# Altium project Dashcam_V2.0B.PrjPcb (part 6 of 9)

## Sheet TYPEC_DATA.SchDoc
size A2; DrawnBy: UKAYACIK; Engineer: UKAYACIK; DocumentNumber: 16; Revision: B; SheetNumber: 16; SheetTotal: 21
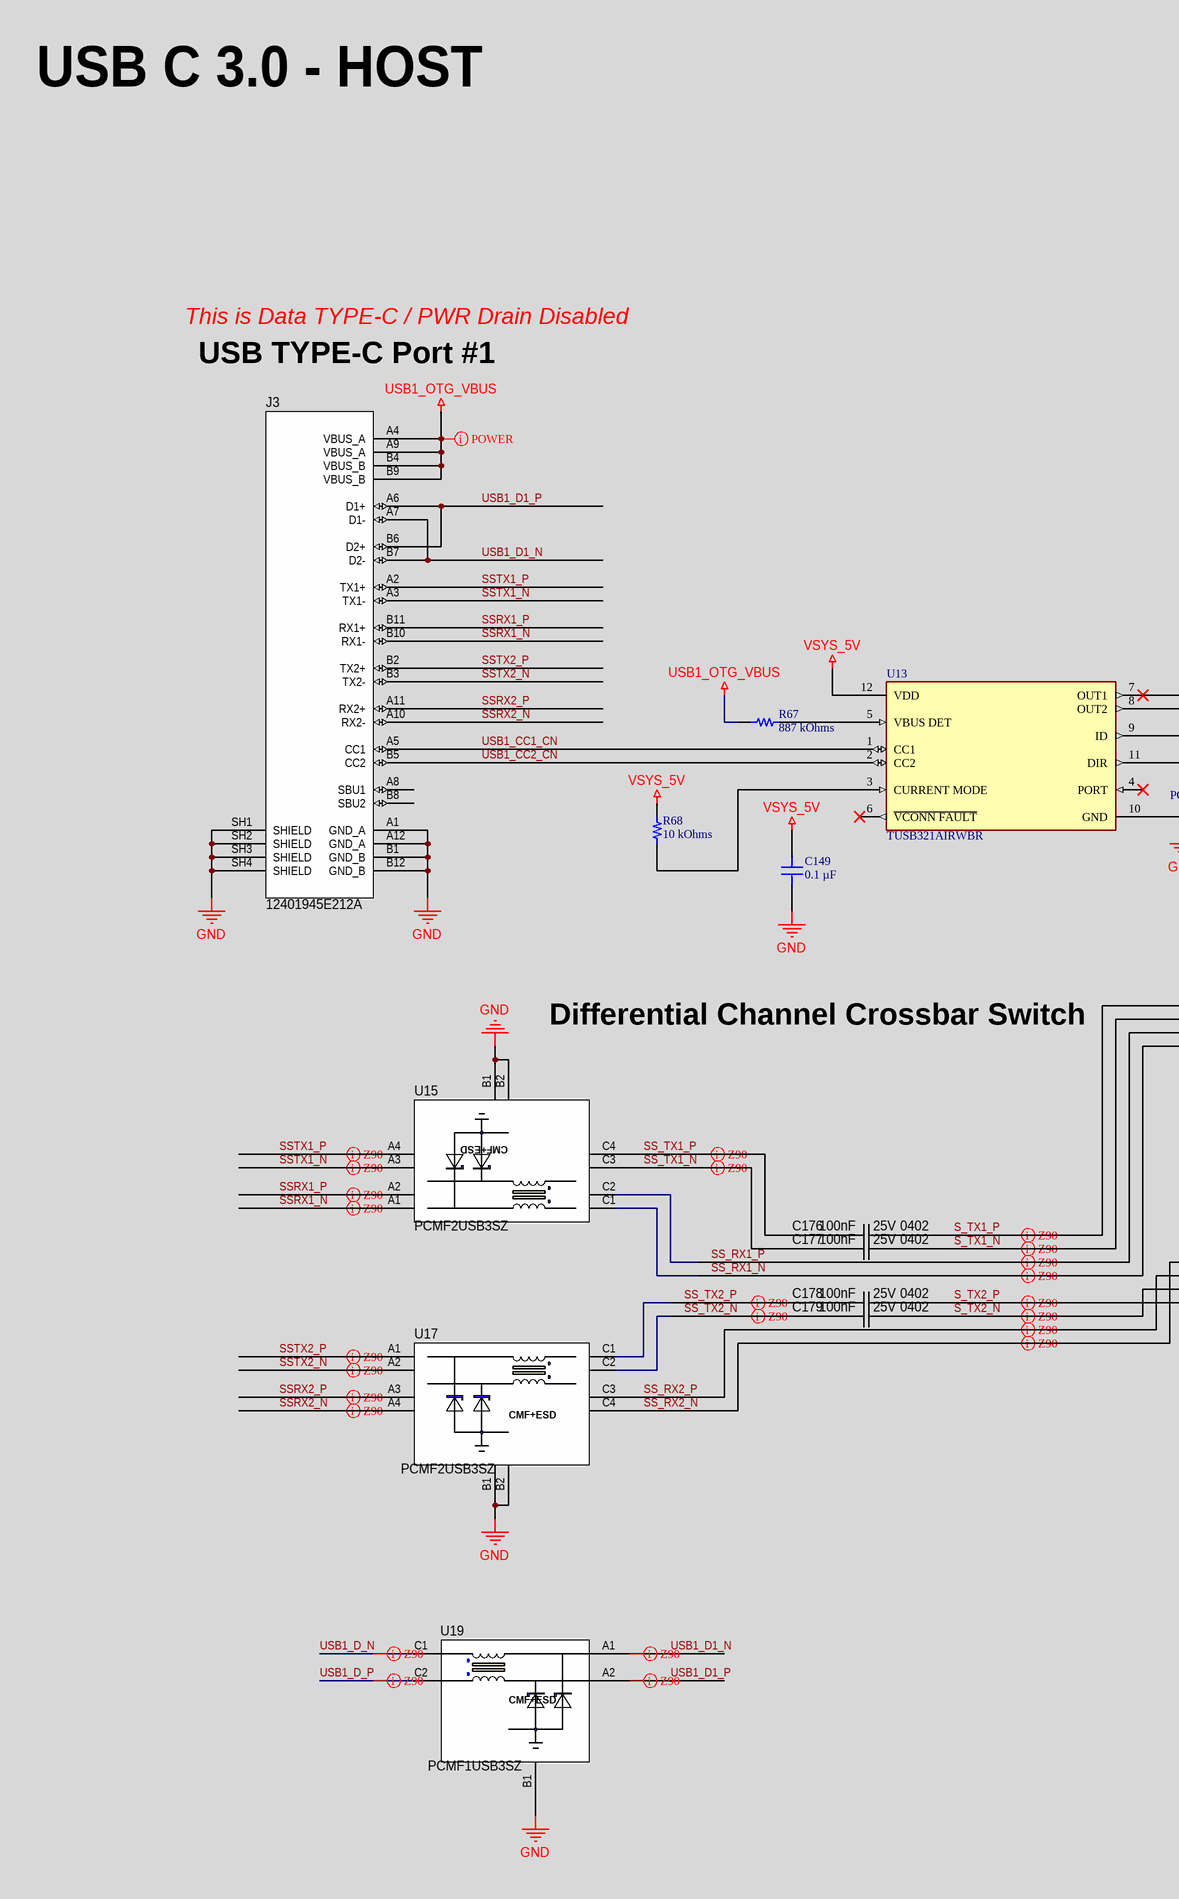
[diagram p18: TYPEC_DATA.SchDoc, left]
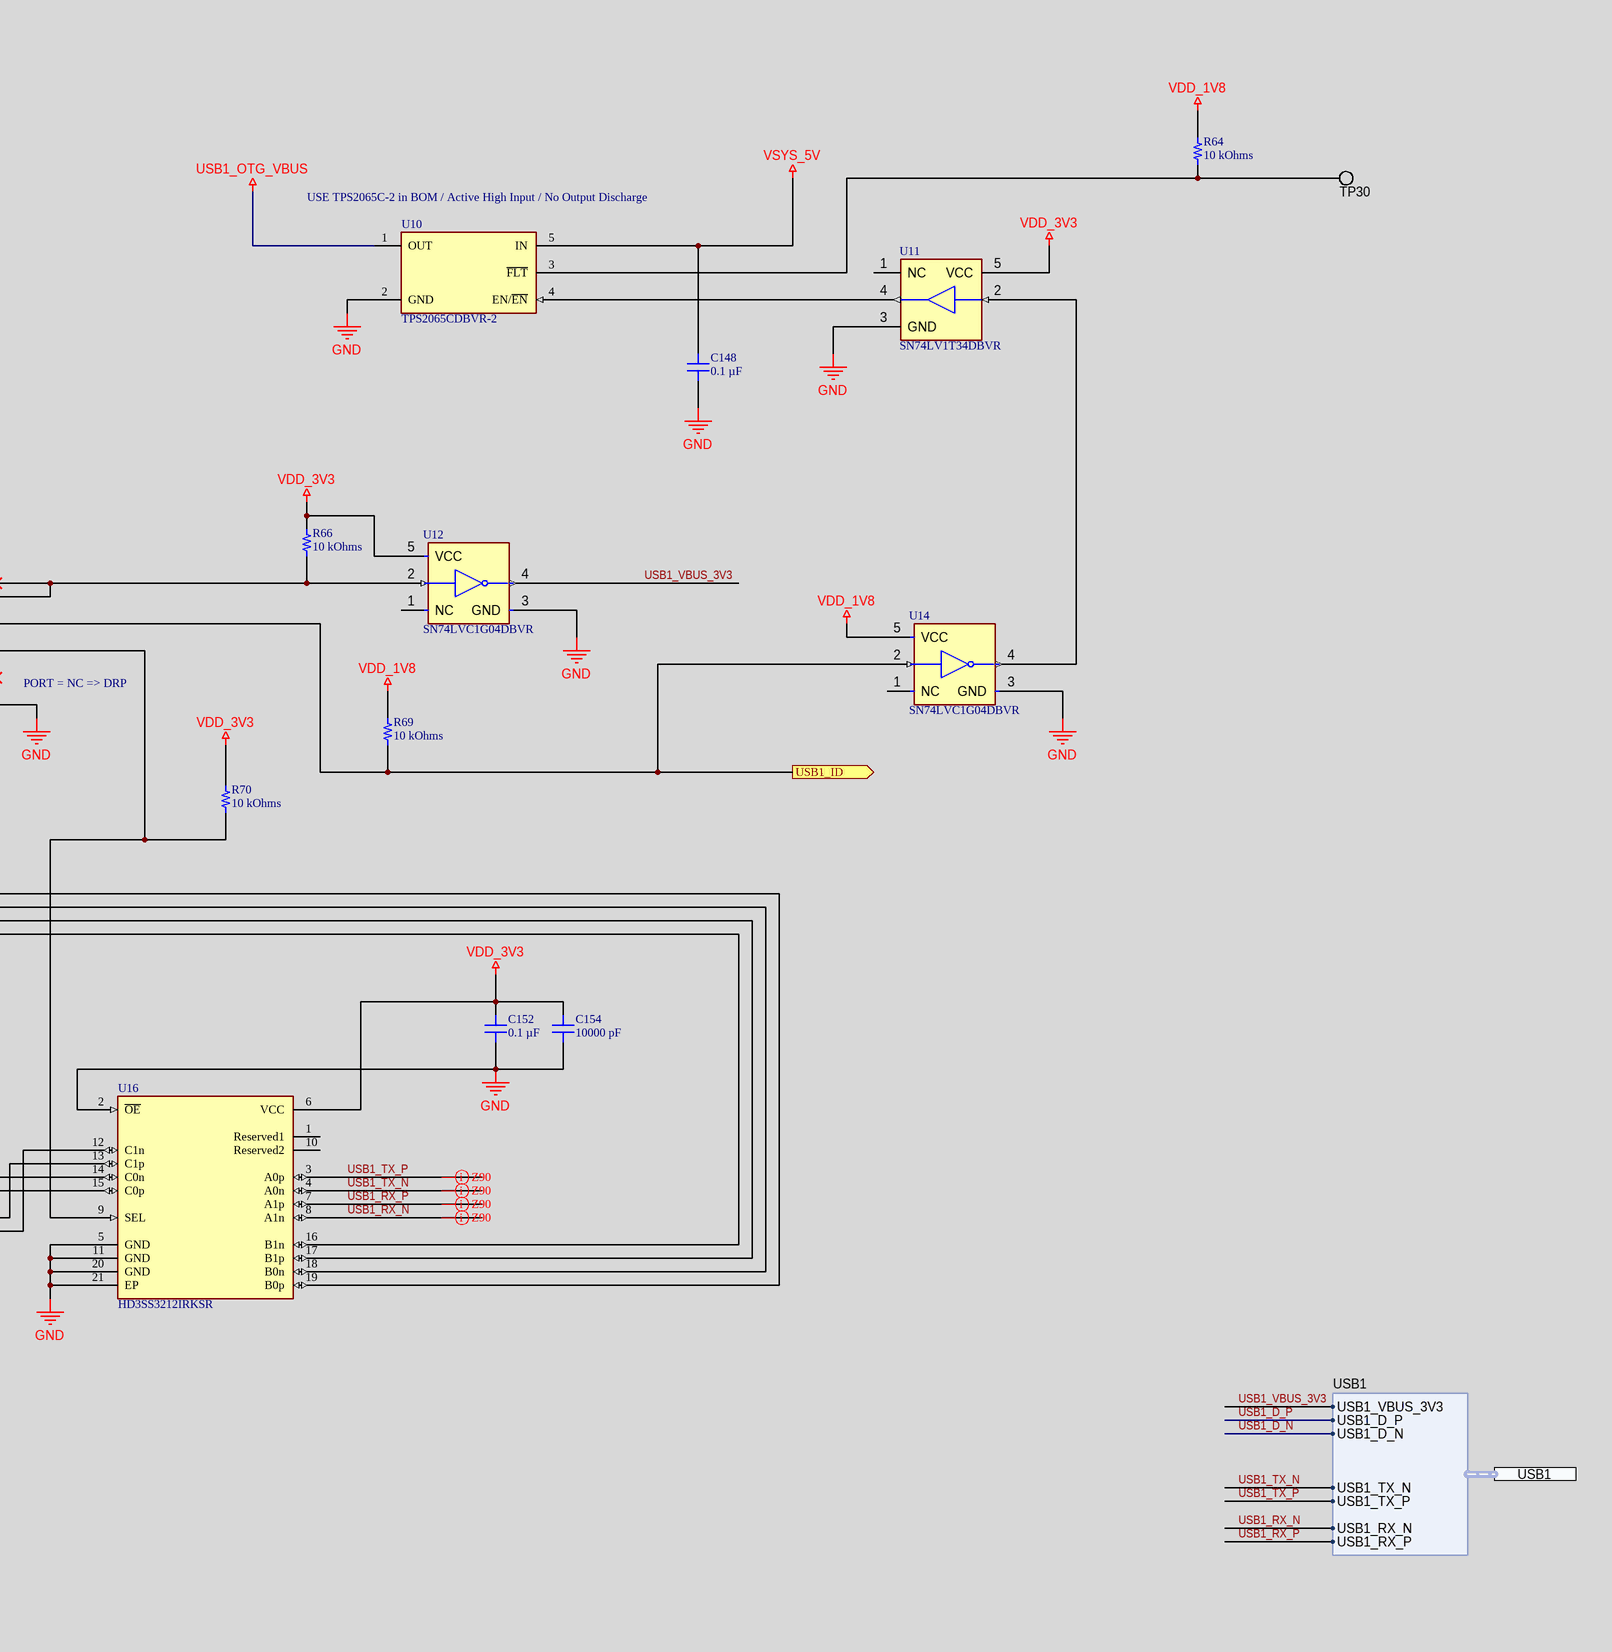
[diagram p19: TYPEC_DATA.SchDoc, right]

### Parts
C148  0.1 µF  [MURATA GCM155 0402_1005]
C149  0.1 µF  [MURATA GCM155 0402_1005]
C152  0.1 µF  [MURATA GCM155 0402_1005]
C154  10000 pF  [CAP 0402_1005]
C176  Capacitance: 100nF  Voltage Rating: 25V  Case/Package: 0402  [CAP_0402_CAPC1005X05N]  (hidden comment: CC0402KRX5R8BB104)
C177  Capacitance: 100nF  Voltage Rating: 25V  Case/Package: 0402  [CAP_0402_CAPC1005X05N]  (hidden comment: CC0402KRX5R8BB104)
C178  Capacitance: 100nF  Voltage Rating: 25V  Case/Package: 0402  [CAP_0402_CAPC1005X05N]  (hidden comment: CC0402KRX5R8BB104)
C179  Capacitance: 100nF  Voltage Rating: 25V  Case/Package: 0402  [CAP_0402_CAPC1005X05N]  (hidden comment: CC0402KRX5R8BB104)
J3  12401945E212A  [CONN_USBC_AMPHENOL_12401945E212A]
R64  10 kOhms  [RES 0402_1005]
R66  10 kOhms  [RES 0402_1005]
R67  887 kOhms  [RES 0805_2012]
R68  10 kOhms  [RES 0402_1005]
R69  10 kOhms  [RES 0402_1005]
R70  10 kOhms  [RES 0402_1005]
TP30  NO COMPONENT  [TP_PAD_0.5MM_SMD_ROUND]  (value not drawn)  (no BOM)
U10  TPS2065CDBVR-2  [FP-DBV0005A-IPC_A]
U11  SN74LV1T34DBVR  [FP-DBV0005A-IPC_B]
U12  SN74LVC1G04DBVR  [FP-DBV0005A-MFG]
U13  TUSB321AIRWBR  [FP-RWB0012A-MFG]
U14  SN74LVC1G04DBVR  [FP-DBV0005A-MFG]
U15  PCMF2USB3SZ  [ESD_PCMF2USB3SZ]
U16  HD3SS3212IRKSR  [FP-RKS0020A-MFG]
U17  PCMF2USB3SZ  [ESD_PCMF2USB3SZ]
U19  PCMF1USB3SZ  [ESD_PESD1USB3BCX]

### Ports
USB1 (harness USB1), USB1_ID (out)

### Harnesses
USB1: USB1_VBUS_3V3, USB1_D_N, USB1_D_P, USB1_TX_N, USB1_TX_P, USB1_RX_N, USB1_RX_P

### Nets
GND: C148.1 C149.1 C152.1 C154.1 J3.A1(GND_A) J3.A12(GND_A) J3.B1(GND_B) J3.B12(GND_B) J3.SH1(SHIELD) J3.SH2(SHIELD) J3.SH3(SHIELD) J3.SH4(SHIELD) U10.2(GND) U11.3(GND) U12.3(GND) U13.10(GND) U14.3(GND) U15.B1(GND_CH1) U15.B2(GND_CH2) U16.2(~{OE}) U16.5(GND) U16.11(GND) U16.20(GND) U16.21(EP) U17.B1(GND_CH1) U17.B2(GND_CH2) U19.B1(ground_channel_1)
USB1_OTG_VBUS: J3.A4(VBUS_A) J3.A9(VBUS_A) J3.B4(VBUS_B) J3.B9(VBUS_B) R67.1 U10.1(OUT)
VDD_1V8: R64.2 R69.2 U14.5(VCC)
VDD_3V3: C152.2 C154.2 R66.2 R70.2 U11.5(VCC) U12.5(VCC) U16.6(VCC)
VSYS_5V: C148.2 C149.2 R68.2 U10.5(IN) U13.12(VDD)
GPIO1_IO15: R69.1 U13.9(ID) U14.2(A) ; port USB1_ID
S_TX1_N: C177.2 U16.18(B0n)
S_TX1_P: C176.2 U16.19(B0p)
S_TX2_N: C179.2 U16.14(C0n)
S_TX2_P: C178.2 U16.15(C0p)
SS_RX1_N: U15.C1(CH1_OUT+) U16.16(B1n)
SS_RX1_P: U15.C2(CH1_OUT-) U16.17(B1p)
SS_RX2_N: U16.12(C1n) U17.C4(CH2_OUT-)
SS_RX2_P: U16.13(C1p) U17.C3(CH2_OUT+)
SS_TX1_N: C177.1 U15.C3(CH2_OUT+)
SS_TX1_P: C176.1 U15.C4(CH2_OUT-)
SS_TX2_N: C179.1 U17.C2(CH1_OUT-)
SS_TX2_P: C178.1 U17.C1(CH1_OUT+)
SSRX1_N: J3.B10(RX1-) U15.A1(CH1_IN+)
SSRX1_P: J3.B11(RX1+) U15.A2(CH1_IN-)
SSRX2_N: J3.A10(RX2-) U17.A4(CH2_IN-)
SSRX2_P: J3.A11(RX2+) U17.A3(CH2_IN+)
SSTX1_N: J3.A3(TX1-) U15.A3(CH2_IN+)
SSTX1_P: J3.A2(TX1+) U15.A4(CH2_IN-)
SSTX2_N: J3.B3(TX2-) U17.A2(CH1_IN-)
SSTX2_P: J3.B2(TX2+) U17.A1(CH1_IN+)
USB1_CC1_CN: J3.A5(CC1) U13.1(CC1)
USB1_CC2_CN: J3.B5(CC2) U13.2(CC2)
USB1_D1_N: J3.A7(D1-) J3.B7(D2-) U19.A1(channel_1+_external)
USB1_D1_P: J3.A6(D1+) J3.B6(D2+) U19.A2(channel_1-_external)
USB1_D_N: U19.C1(channel_1+_internal) ; port USB1.USB1_D_N
USB1_D_P: U19.C2(channel_1-_internal) ; port USB1.USB1_D_P
USB1_RX_N: U16.8(A1n) ; port USB1.USB1_RX_N
USB1_RX_P: U16.7(A1p) ; port USB1.USB1_RX_P
USB1_TX_N: U16.4(A0n) ; port USB1.USB1_TX_N
USB1_TX_P: U16.3(A0p) ; port USB1.USB1_TX_P
USB1_VBUS_3V3: U12.4(Y) ; port USB1.USB1_VBUS_3V3
NetR64_1: R64.1 TP30.1 U10.3(~{FLT})
NetR66_1: R66.1 U12.2(A) U13.7(OUT1) U13.8(OUT2)
NetR67_2: R67.2 U13.5(VBUS_DET)
NetR68_1: R68.1 U13.3(CURRENT_MODE)
NetR70_1: R70.1 U13.11(DIR) U16.9(SEL)
NetU10_4: U10.4(EN/~{EN}) U11.4(Y)
NetU11_2: U11.2(A) U14.4(Y)

Not connected (* = marked no-connect by the designer): J3 A8(SBU1) B8(SBU2); U11 1(NC); U12 1(NC); U13 4(PORT)* 6(~{VCONN_FAULT})*; U14 1(NC); U16 1(Reserved1) 10(Reserved2)

### Layout directives
differential pair; differential pair class Z90: S_TX1_N, S_TX1_P, S_TX2_N, S_TX2_P, SS_RX1_N, SS_RX1_P, SS_RX2_N, SS_RX2_P, SS_TX1_N, SS_TX1_P, SS_TX2_N, SS_TX2_P, SSRX1_N, SSRX1_P, SSRX2_N, SSRX2_P, SSTX1_N, SSTX1_P, SSTX2_N, SSTX2_P, USB1_D1_N, USB1_D1_P, USB1_D_N, USB1_D_P, USB1_RX_N, USB1_RX_P, USB1_TX_N, USB1_TX_P
net class POWER: USB1_OTG_VBUS

### Notes on the sheet
- USB C 3.0 - HOST
- (near U10) USE TPS2065C-2 in BOM / Active High Input / No Output Discharge
- This is Data TYPE-C / PWR Drain Disabled
- USB TYPE-C Port #1
- PORT = NC => DRP
- Differential Channel Crossbar Switch
- PCB Des :
- Approv By :
- Project Title :
- Sheet Title :
- Date :
- Page :
- PCB Version :
- PCB Revision :
- Size :
- A2
- (in symbol ESD_EMI_PCMF1USB3SZ) CMF+ESD
- (in symbol ESD_EMI_PCMF2USB3SZ) CMF+ESD

### Library data of the parts
C148 C149 C152 = GCM155R71E104KE02D: CAP CER 0.1UF 25V X7R 0402; manufacturer: Murata Electronics; Tolerance: ±10%; Part Number: GCM155R71E104KE02D; Capacitance: 0.1 µF; Applications: Automotive; componentlink1description: Datasheet; componentlink1url: https://search.murata.co.jp/Ceramy/image/img/A01X/G101/ENG/GCM155R71E104KE02-01.pdf; componentlink2description: DigiKey Link; componentlink2url: https://www.digikey.com/en/products/detail/murata-electronics/GCM155R71E104KE02D/7363175; Device Package: 0402 (1005 Metric); lastupdated: 7/20/2024 2:04:19 AM; Lifecycle Status: Active; Minimum Order: 1; Mounting Type: Surface Mount, MLCC; Operating Temperature: -55°C ~ 125°C; Package / Case: 0402 (1005 Metric); packaging: TapeAndReel; partid: 2051; Part Status: Active; price: 0.01; Ratings: AEC-Q200; series: GCM; Size / Dimension: 0.039" L x 0.020" W (1.00mm x 0.50mm); Supplier 1: DigiKey; Supplier Part Number 1: 490-16431-1-ND; Temperature Coefficient: X7R; Thickness (Max): 0.022" (0.55mm); value: 0.1 µF; Voltage - Rated: 25V
C154 = C0402C103M5RECAUTO: CAP CER 0402 10NF 50V X7R 20%; manufacturer: KEMET; Part Number: C0402C103M5RECAUTO; Capacitance: 10000 pF; Applications: Automotive, ESD Protection; componentlink1description: Datasheet; componentlink1url: https://api.kemet.com/component-edge/download/datasheet/C0402C103M5RECAUTO.pdf; componentlink2description: DigiKey Link; componentlink2url: https://www.digikey.com/en/products/detail/kemet/C0402C103M5RECAUTO/8646509; Device Package: 0402 (1005 Metric); lastupdated: 2/9/2024 8:04:13 PM; Lifecycle Status: Active; Minimum Order: 1; Mounting Type: Surface Mount, MLCC; Operating Temperature: -55°C ~ 125°C; Package / Case: 0402 (1005 Metric); packaging: TapeAndReel; partid: 33125; Part Status: Active; price: 0.01; Ratings: AEC-Q200; series: ESD SMD Auto X7R; Size / Dimension: 0.039" L x 0.020" W (1.00mm x 0.50mm); Supplier 1: DigiKey; Supplier Part Number 1: 399-C0402C103M5RECAUTOCT-ND; Temperature Coefficient: X7R; Thickness (Max): 0.022" (0.55mm); Tolerance: ±20%; value: 10000 pF; Voltage - Rated: 50V
C176-C179 = CAP_100NF_25V_X7R_0402: Multilayer Ceramic Capacitor, 0.1 uF, 25 V, ± 10%, X7R, 0402 [1005 Metric]; Manufacturer: Yageo; Material: 4241ConductorMaterial; Dielectric: X5R; Temperature Coefficient: 30ppm/°C; Supplier 1: Digikey; Manufacturer Part Number: CC0402KRX5R8BB104; RoHS: Yes; Category: Ceramic Capacitors; Stock 1: 3706055; Pricing 1: 1=0.1, 10=0.037, 50=0.021, 100=0.0162, 500=0.01224, 1000=0.00961, 2500=0.00874, 5000=0.00804 (USD); Mount: Surface Mount; Case Code (Metric): 1005; Case Code (Imperial): 0402; Min Operating Temperature: -55°C; Max Operating Temperature: 85°C; Tolerance: 10%; Packaging: Tape and Reel; Voltage Rating (DC): 25V; Series: CC; RoHS Compliant: Yes; Lead Free: 5697LeadFree; Halogen Free: 5694HalogenFree; ComponentLink1URL: http://www.mouser.com/ds/2/447/UPY-GPHC_X5R_4V-to-50V_25-1131599.pdf?src-supplier=Mouser; ComponentLink1Description: http://www.mouser.com/ds/2/447/UPY-GPHC_X5R_4V-to-50V_25-1131599.pdf?src-supplier=Mouser; ComponentLink2URL: https://datasheet.octopart.com/CC0402KRX5R8BB104-Yageo-datasheet-137700082.pdf?src-supplier=Future+Electronics; ComponentLink2Description: https://datasheet.octopart.com/CC0402KRX5R8BB104-Yageo-datasheet-137700082.pdf?src-supplier=Future+Electronics; ComponentLink3URL: http://www.yageo.com/documents/recent/UPY-GPHC_X5R_4V-to-50V_25.pdf?src-supplier=Digikey; ComponentLink3Description: http://www.yageo.com/documents/recent/UPY-GPHC_X5R_4V-to-50V_25.pdf?src-supplier=Digikey; ComponentLink4URL: https://datasheet.octopart.com/CC0402KRX5R8BB104-Yageo-datasheet-140260304.pdf?src-supplier=Newark; ComponentLink4Description: https://datasheet.octopart.com/CC0402KRX5R8BB104-Yageo-datasheet-140260304.pdf?src-supplier=Newark; ComponentLink5URL: https://datasheet.octopart.com/CC0402KRX5R8BB104-Yageo-datasheet-170350636.pdf?src-supplier=Future+Electronics; ComponentLink5Description: https://datasheet.octopart.com/CC0402KRX5R8BB104-Yageo-datasheet-170350636.pdf?src-supplier=Future+Electronics; ComponentLink6URL: http://www.yageo.com/documents/recent/UPY-GPHC_X5R_4V-to-50V-16.pdf?src-supplier=Future+Electronics; ComponentLink6Description: http://www.yageo.com/documents/recent/UPY-GPHC_X5R_4V-to-50V-16.pdf?src-supplier=Future+Electronics; Supplier Part Number 1: 311-1697-6-ND
J3 = CONN_USB_TYPEC_3.2_12401945E212A: USB3.2 GEN1, Type C, Top mount, CH 1.53mm, Dual Row SMT / Tap/Rl; Manufacturer: Amphenol ICC / FCI; Supplier 1: Digikey; Manufacturer Part Number: 12401945E212A; RoHS: No; Category: Connectors; Stock 1: 12310; Pricing 1: 1=1.63, 10=1.415, 25=1.3544, 50=1.3242, 100=1.2641, 250=1.14372, 500=1.05342 (USD); Supplier Part Number 1: 664-12401945E212ACT-ND
R64 R66 R68-R70 = MCS0402MC1002FE000: RES SMD 10K OHM 1% 1/10W 0402; Manufacturer: Vishay Beyschlag; Power (Watts): 0.1W, 1/10W; Temperature Coefficient: ±50ppm/°C; Part Number: MCS0402MC1002FE000; Value: 10 kOhms; ComponentLink1Description: Datasheet; ComponentLink1URL: http://www.vishay.com/docs/28760/mcat_pro.pdf; ComponentLink2Description: DigiKey Link; ComponentLink2URL: http://digikey.com/product-detail/en/vishay-beyschlag/MCS0402MC1002FE000/MCS0402-10.0K-MFCT-ND/3883092; Composition: Thin Film; Device Package: 0402 (1005 Metric); Features: Anti-Sulfur, Automotive AEC-Q200; Height - Seated (Max): 0.015" (0.37mm); LastUpdated: 2/9/2024 8:30:21 PM; Lifecycle Status: Active; Minimum Order: 1; Number of Terminations: 2; Operating Temperature: -55°C ~ 175°C; Package / Case: 0402 (1005 Metric); Packaging: TapeAndReel; PartId: 3152; Part Status: Active; Price: 0.03; Ratings: AEC-Q200; Resistance: 10 kOhms; Series: MCS AT - Professional; Size / Dimension: 0.039" L x 0.020" W (1.00mm x 0.50mm); Supplier 1: DigiKey; Supplier Part Number 1: MCS0402-10.0K-MFCT-ND; Supplier Device Package: 0402; Tolerance: ±1%
R67 = CRCW0805887KFKEA: RES SMD 887K OHM 1% 1/8W 0805; Manufacturer: Vishay Dale; Power (Watts): 0.125W, 1/8W; Temperature Coefficient: ±100ppm/°C; Part Number: CRCW0805887KFKEA; Value: 887 kOhms; ComponentLink1Description: Datasheet; ComponentLink1URL: http://www.vishay.com/docs/20035/dcrcwe3.pdf; ComponentLink2Description: DigiKey Link; ComponentLink2URL: https://www.digikey.com/en/products/detail/vishay-dale/CRCW0805887KFKEA/1176010; Composition: Thick Film; Device Package: 0805 (2012 Metric); Features: Automotive AEC-Q200; Height - Seated (Max): 0.020" (0.50mm); LastUpdated: 2/8/2024 9:02:16 PM; Lifecycle Status: Active; Minimum Order: 1; Number of Terminations: 2; Operating Temperature: -55°C ~ 155°C; Package / Case: 0805 (2012 Metric); Packaging: TapeAndReel; PartId: 32881; Part Status: Active; Price: 0.01; Ratings: AEC-Q200; Resistance: 887 kOhms; Series: CRCW; Size / Dimension: 0.079" L x 0.049" W (2.00mm x 1.25mm); Supplier 1: DigiKey; Supplier Part Number 1: 541-887KCCT-ND; Supplier Device Package: 0805; Tolerance: ±1%
TP30 = TP_PAD_SMD_SMALL: as TP24-TP28 on sheet eMMC FLASH
U10 = CMP-04913-000050-1: IC PWR SWITCH N-CHAN 1:1 SOT23-5; Max Input Voltage: 5.5V; Turn-On Delay Time: 2.4ms; Min Input Voltage: 4.5V; Output Current: 1A; Number of Outputs: 1; Max Supply Current: 75uA; On-State Resistance: 86mR; Turn-Off Delay Time: 3.25ms; Packaging: Tape and Reel; Case/Package: SOT-23-5; Series: TPS2065C-2; RoHS Compliant: Yes; Mount: Surface Mount; Operating Supply Voltage: 5.5V; Number of Switches: 1; Min Operating Temperature: -40°C; Max Operating Temperature: 85°C; Package Quantity: 3000; Number of Pins: 5; Lead Free: Lead Free
U11 = CMP-0859-00123-4: IC BUF NON-INVERT 5.5V SOT23-5; Low Level Output Current: 8mA; Polarity: Non-Inverting; Number of Channels: 1; Propagation Delay: 15.5ns; High Level Output Current: -8mA; Quiescent Current: 1uA; Logic Function: Buffer; Min Supply Voltage: 1.6V; Min Operating Temperature: -40°C; Package Quantity: 3000; Max Operating Temperature: 125°C; Operating Supply Current: 8mA; Radiation Hardening: No; REACH SVHC: No SVHC; Number of Bits per Element: 1; Mount: Surface Mount; Number of Outputs: 1; Lead Free: Lead Free; Number of Pins: 5; Weight: 0.000353oz; Number of Output Lines: 1; Number of Elements: 1; Number of Input Lines: 1; Number of Bits: 1; Case/Package: SOT-23-5; Packaging: Tape and Reel; Max Supply Voltage: 5.5V; Number of Inputs: 1
U12 U14 = CMP-0859-00134-4: IC INVERTER 1CH 1-INP SOT23-5; Number of Elements: 1; Turn-On Delay Time: 7.5ns; Propagation Delay: 3.7ns; Max Supply Voltage: 5.5V; Max Output Current: 32mA; Quiescent Current: 10uA; High Level Output Current: -32mA; Schmitt Trigger Input: No; Min Supply Voltage: 1.65V; Number of Circuits: 1; Lead Free: Lead Free; Number of Inputs: 1; Mount: Surface Mount; Length: 3.05mm; Width: 1.75mm; Number of Pins: 5; Case/Package: SOT-23; REACH SVHC: No SVHC; Low Level Output Current: 32mA; Package Quantity: 1; Height: 1.3mm; Radiation Hardening: No; Packaging: Tape and Reel; Output Current: 32mA; Max Operating Temperature: 125°C; Termination: SMD/SMT; Min Operating Temperature: -40°C; Number of Gates: 1; Weight: 0.000557oz; Logic Function: Inverter; Number of Bits: 1; Contact Plating: Tin
U13 = CMP-04877-000015-1: IC INTERFACE SPECIALIZED 12X2QFN; Min Supply Voltage: 4.5V; USB Standard: USB 1.0; Number of Ports: 1; Max Supply Voltage: 5.5V; Packaging: Cut Tape; REACH SVHC: No SVHC; Number of Pins: 12; RoHS Compliant: Yes; Min Operating Temperature: -40°C; Mount: Surface Mount; Lead Free: Lead Free; Max Operating Temperature: 85°C
U15 U17 = ESD_EMI_PCMF2USB3SZ: PCMFxUSB3S - Common-mode EMI filter for differential channels with integrated ESD protection; Manufacturer: Nexperia; Supplier 1: Digikey; Manufacturer Part Number: PCMF2USB3SZ; RoHS: Yes; Category: Common Mode Chokes; Stock 1: 45981; Pricing 1: 1=0.72, 10=0.62, 100=0.4295, 500=0.35888, 1000=0.30542, 2000=0.27202 (USD); RoHS Compliant: Yes; ComponentLink1URL: http://www.farnell.com/datasheets/2043701.pdf?src-supplier=Farnell; ComponentLink1Description: http://www.farnell.com/datasheets/2043701.pdf?src-supplier=Farnell; ComponentLink2URL: http://datasheet.octopart.com/PCMF2USB3SZ-Nexperia-datasheet-97399282.pdf?src-supplier=Rs; ComponentLink2Description: http://datasheet.octopart.com/PCMF2USB3SZ-Nexperia-datasheet-97399282.pdf?src-supplier=Rs; ComponentLink3URL: http://datasheet.octopart.com/PCMF2USB3SZ-Nexperia-datasheet-97399282.pdf?src-supplier=Mouser; ComponentLink3Description: http://datasheet.octopart.com/PCMF2USB3SZ-Nexperia-datasheet-97399282.pdf?src-supplier=Mouser; ComponentLink4URL: http://datasheet.octopart.com/PCMF2USB3SZ-Nexperia-datasheet-97399282.pdf?src-supplier=Avnet; ComponentLink4Description: http://datasheet.octopart.com/PCMF2USB3SZ-Nexperia-datasheet-97399282.pdf?src-supplier=Avnet; ComponentLink5URL: https://datasheet.octopart.com/PCMF2USB3SZ-Nexperia-datasheet-62320956.pdf?src-supplier=Newark; ComponentLink5Description: https://datasheet.octopart.com/PCMF2USB3SZ-Nexperia-datasheet-62320956.pdf?src-supplier=Newark; ComponentLink6URL: https://assets.nexperia.com/documents/data-sheet/PCMFXUSB3S_SER.pdf?src-supplier=Digikey; ComponentLink6Description: https://assets.nexperia.com/documents/data-sheet/PCMFXUSB3S_SER.pdf?src-supplier=Digikey; ComponentLink7URL: http://datasheet.octopart.com/PCMF2USB3SZ-Nexperia-datasheet-97399282.pdf?src-supplier=Digikey; ComponentLink7Description: http://datasheet.octopart.com/PCMF2USB3SZ-Nexperia-datasheet-97399282.pdf?src-supplier=Digikey; ComponentLink8URL: http://datasheet.octopart.com/PCMF2USB3SZ-Nexperia-datasheet-97399282.pdf?src-supplier=Future+Electronics; ComponentLink8Description: http://datasheet.octopart.com/PCMF2USB3SZ-Nexperia-datasheet-97399282.pdf?src-supplier=Future+Electronics; ComponentLink9URL: http://datasheet.octopart.com/PCMF2USB3SZ-Nexperia-datasheet-97399282.pdf?src-supplier=Verical; ComponentLink9Description: http://datasheet.octopart.com/PCMF2USB3SZ-Nexperia-datasheet-97399282.pdf?src-supplier=Verical; ComponentLink10URL: https://datasheet.octopart.com/PCMF2USB3SZ-Nexperia-datasheet-97399282.pdf?src-supplier=LKR; ComponentLink10Description: https://datasheet.octopart.com/PCMF2USB3SZ-Nexperia-datasheet-97399282.pdf?src-supplier=LKR; ComponentLink11URL: https://datasheet.octopart.com/PCMF2USB3SZ-Nexperia-datasheet-137234894.pdf?src-supplier=TME; ComponentLink11Description: https://datasheet.octopart.com/PCMF2USB3SZ-Nexperia-datasheet-137234894.pdf?src-supplier=TME; Supplier Part Number 1: 1727-2509-1-ND
U16 = CMP-04877-000012-1: IC MUX 2:1 8 OHM 20VQFN; USB Standard: USB 3.1; Min Supply Voltage: 3V; Max Supply Voltage: 3.6V; Data Rate: 480Mbps; Number of Ports: 2; Bandwidth: 8GHz; REACH SVHC: No SVHC; Lead Free: Lead Free; Max Operating Temperature: 85°C; Packaging: Tape and Reel; Case/Package: VQFN; Number of Pins: 20; Min Operating Temperature: -40°C
U19 = ESD_EMI_PCMF1USB3SZ: PCMFxUSB3S - Common-mode EMI filter for differential channels with integrated ESD protection; Manufacturer: Nexperia; Supplier 1: Digikey; Manufacturer Part Number: PCMF1USB3SZ; RoHS: Yes; Category: Common Mode Chokes; Stock 1: 25964; Pricing 1: 1=0.5, 10=0.387, 100=0.2321, 500=0.21488, 1000=0.14612, 2000=0.13452 (USD); RoHS Compliant: Yes; ComponentLink1URL: http://www.farnell.com/datasheets/2043701.pdf?src-supplier=Farnell; ComponentLink1Description: http://www.farnell.com/datasheets/2043701.pdf?src-supplier=Farnell; ComponentLink2URL: https://assets.nexperia.com/documents/data-sheet/PCMFXUSB3S_SER.pdf?src-supplier=Digikey; ComponentLink2Description: https://assets.nexperia.com/documents/data-sheet/PCMFXUSB3S_SER.pdf?src-supplier=Digikey; ComponentLink3URL: http://www.farnell.com/datasheets/2043701.pdf?src-supplier=Newark; ComponentLink3Description: http://www.farnell.com/datasheets/2043701.pdf?src-supplier=Newark; ComponentLink4URL: http://www.farnell.com/datasheets/2043701.pdf?src-supplier=Element14; ComponentLink4Description: http://www.farnell.com/datasheets/2043701.pdf?src-supplier=Element14; ComponentLink5URL: https://datasheet.octopart.com/PCMF1USB3SZ-Nexperia-datasheet-137234894.pdf?src-supplier=TME; ComponentLink5Description: https://datasheet.octopart.com/PCMF1USB3SZ-Nexperia-datasheet-137234894.pdf?src-supplier=TME; Supplier Part Number 1: 1727-2508-1-ND

## Sheet uSD CARD.SchDoc
size A2; DrawnBy: UKAYACIK; Engineer: UKAYACIK; DocumentNumber: 17; SheetNumber: 17; SheetTotal: 21
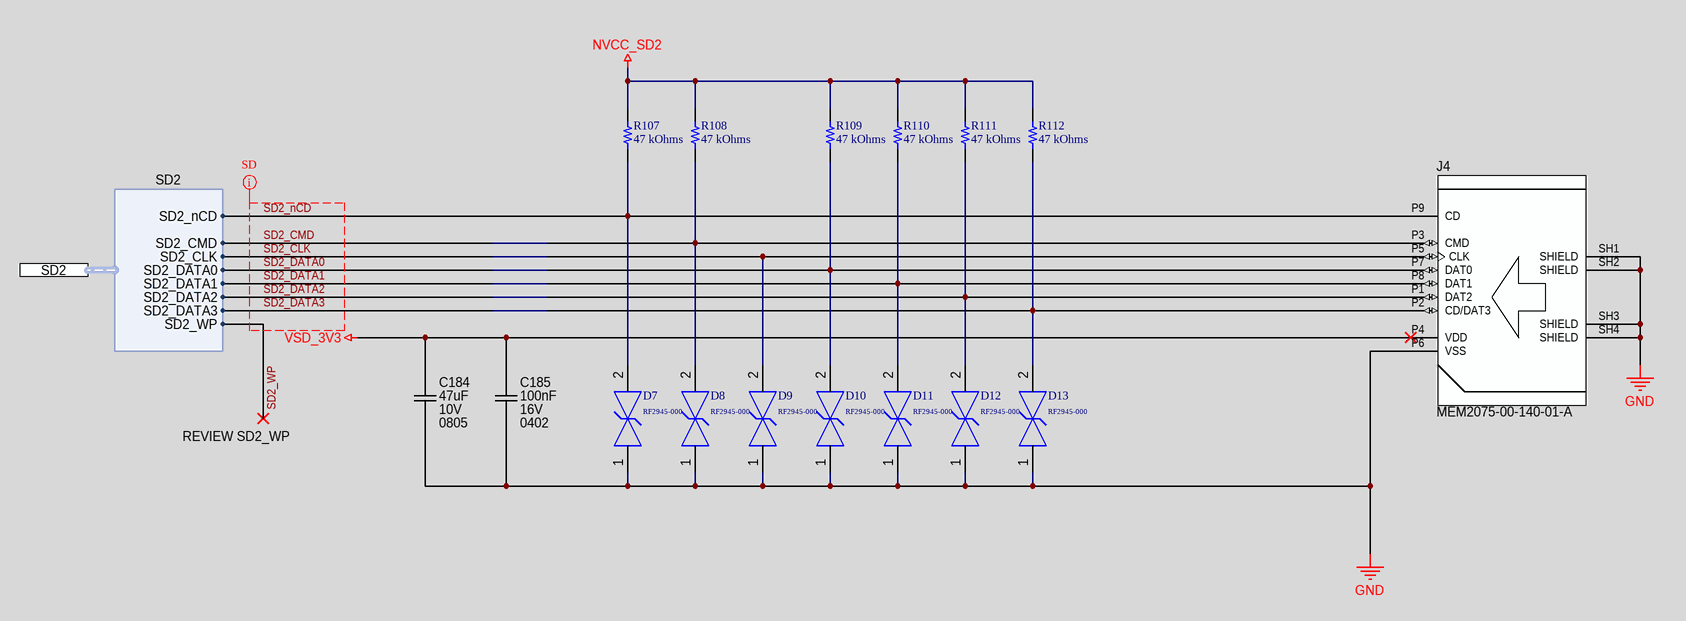
[diagram p20: uSD CARD.SchDoc]

### Parts
C184  Voltage Rating (DC): 10V  Capacitance: 47uF  Case Code (Imperial): 0805  [CAP_0805_CAPC2012X12N]  (hidden comment: C2012X5R1A476M125AC)
C185  Voltage Rating: 16V  Capacitance: 100nF  Case/Package: 0402  [CAP_0402_CAPC1005X05N]  (hidden comment: CL05B104KO5NNNC)
D7  RF2945-000  [FP-SESD0402-MFG]
D8  RF2945-000  [FP-SESD0402-MFG]
D9  RF2945-000  [FP-SESD0402-MFG]
D10  RF2945-000  [FP-SESD0402-MFG]
D11  RF2945-000  [FP-SESD0402-MFG]
D12  RF2945-000  [FP-SESD0402-MFG]
D13  RF2945-000  [FP-SESD0402-MFG]
J4  MEM2075-00-140-01-A  [CONN_MICROSD_GCT_MEM2075-00-140-01-A]
R107  47 kOhms  [RES 0402_1005]
R108  47 kOhms  [RES 0402_1005]
R109  47 kOhms  [RES 0402_1005]
R110  47 kOhms  [RES 0402_1005]
R111  47 kOhms  [RES 0402_1005]
R112  47 kOhms  [RES 0402_1005]

### Ports
SD2 (harness SD2)

### Harnesses
SD2: SD2_nCD, SD2_CMD, SD2_CLK, SD2_DATA0, SD2_DATA1, SD2_DATA2, SD2_DATA3, SD2_WP

### Nets
GND: C184.1 C185.1 D7.1 D8.1 D9.1 D10.1 D11.1 D12.1 D13.1 J4.P6(VSS) J4.SH1(SHIELD) J4.SH2(SHIELD) J4.SH3(SHIELD) J4.SH4(SHIELD)
NVCC_SD2: R107.2 R108.2 R109.2 R110.2 R111.2 R112.2
VSD_3V3: C184.2 C185.2 J4.P4(VDD)
SD2_CLK: D9.2 J4.P5(CLK) ; port SD2.SD2_CLK
SD2_CMD: D8.2 J4.P3(CMD) R108.1 ; port SD2.SD2_CMD
SD2_DATA0: D10.2 J4.P7(DAT0) R109.1 ; port SD2.SD2_DATA0
SD2_DATA1: D11.2 J4.P8(DAT1) R110.1 ; port SD2.SD2_DATA1
SD2_DATA2: D12.2 J4.P1(DAT2) R111.1 ; port SD2.SD2_DATA2
SD2_DATA3: D13.2 J4.P2(CD/DAT3) R112.1 ; port SD2.SD2_DATA3
SD2_nCD: D7.2 J4.P9(CD) R107.1 ; port SD2.SD2_nCD
SD2_WP: port SD2.SD2_WP

### Layout directives
net class MICROSD: SD2_CLK, SD2_CMD, SD2_DATA0, SD2_DATA1, SD2_DATA2, SD2_DATA3, SD2_nCD

### Notes on the sheet
- (near J4) Micro-SD
- (near J4) # Push-Push
- REVIEW SD2_WP
- PCB Des :
- Approv By :
- Project Title :
- Sheet Title :
- Date :
- Page :
- PCB Version :
- PCB Revision :
- Size :
- A2

### Library data of the parts
C184 = CAP_47UF_10V_X5R_0805: Multilayer Ceramic Capacitor, 47 uF, 10 V, ± 20%, X5R, 0805 [2012 Metric]; Manufacturer: TDK; Material: 4241ConductorMaterial; Supplier 1: Digikey; Manufacturer Part Number: C2012X5R1A476M125AC; RoHS: Yes; Category: Ceramic Capacitors; Stock 1: 476295; Pricing 1: 1=0.79, 10=0.572, 50=0.5006, 100=0.4079, 500=0.33372, 1000=0.28737 (USD); Mount: Surface Mount; Case/Package: 0805; Dielectric Material: Ceramic; Case Code (Metric): 2012; Weight: 0.000194oz; Min Operating Temperature: -55°C; Max Operating Temperature: 85°C; Tolerance: 20%; Packaging: Tape and Reel; Dielectric: X5R; Package Quantity: 1; Voltage Rating: 10V; Termination: SMD/SMT; Voltage: 10V; Series: C; Length: 2mm; Width: 0.049inch; Height: 1.25mm; Depth: 1.25mm; Thickness: 0.057inch; Lead Free: Lead Free; Reach SVHC Compliant: No; RoHS Compliant: Yes; ComponentLink1URL: https://datasheet.ciiva.com/24216/c2012x5r1a476m125ac-264921-24216523.pdf?src-supplier=Mouser; ComponentLink1Description: https://datasheet.ciiva.com/24216/c2012x5r1a476m125ac-264921-24216523.pdf?src-supplier=Mouser; ComponentLink2URL: https://datasheet.ciiva.com/24191/c2012x5r1a476m125ac-24191773.pdf?src-supplier=Future+Electronics; ComponentLink2Description: https://datasheet.ciiva.com/24191/c2012x5r1a476m125ac-24191773.pdf?src-supplier=Future+Electronics; ComponentLink3URL: https://datasheet.ciiva.com/7975/1796654-7975085.pdf?src-supplier=Element14; ComponentLink3Description: https://datasheet.ciiva.com/7975/1796654-7975085.pdf?src-supplier=Element14; ComponentLink4URL: https://datasheet.ciiva.com/22694/1796654-22694142.pdf?src-supplier=Element14; ComponentLink4Description: https://datasheet.ciiva.com/22694/1796654-22694142.pdf?src-supplier=Element14; ComponentLink5URL: https://datasheet.ciiva.com/6259/tdkmlcccaprange-6259576.pdf?src-supplier=Digikey; ComponentLink5Description: https://datasheet.ciiva.com/6259/tdkmlcccaprange-6259576.pdf?src-supplier=Digikey; ComponentLink6URL: https://datasheet.ciiva.com/6259/tdkmlcccaprange-6259575.pdf?src-supplier=Digikey; ComponentLink6Description: https://datasheet.ciiva.com/6259/tdkmlcccaprange-6259575.pdf?src-supplier=Digikey; ComponentLink7URL: https://datasheet.ciiva.com/6259/tdkmlcccaprange-6259577.pdf?src-supplier=Digikey; ComponentLink7Description: https://datasheet.ciiva.com/6259/tdkmlcccaprange-6259577.pdf?src-supplier=Digikey; Supplier Part Number 1: 445-8239-6-ND
C185 = CAP_100NF_16V_X7R_0402: Multilayer Ceramic Capacitor, 0.1 uF, 16 V, ± 10%, X7R, 0402 [1005 Metric]; Manufacturer: Samsung; Supplier 1: Digi-Key; Manufacturer Part Number: CL05B104KO5NNNC; RoHS: Yes; Category: Ceramic Capacitors; Stock 1: 11081064; Pricing 1: 1=0.1, 10=0.024, 50=0.013, 100=0.0105, 500=0.00752, 1000=0.00592, 2500=0.00538, 5000=0.00495 (USD); Mount: Surface Mount; Case Code (Metric): 1005; Case Code (Imperial): 0402; Material: Ceramic; Min Operating Temperature: -55°C; Max Operating Temperature: 125°C; Tolerance: 10%; Package Quantity: 1; Packaging: Tape and Reel; Dielectric: X7R; Series: CL; Voltage: 16V; Voltage Rating (DC): 16V; Construction: Flat; Length: 1mm; Width: 0.02inch; Height: 0.5mm; Thickness: 0.022inch; Depth: 0.5mm; Radiation Hardening: No; RoHS Compliant: Yes; Lead Free: Lead Free; ComponentLink1URL: https://datasheet.ciiva.com/26920/getdatasheetpartid-359683-26920169.pdf?src-supplier=Verical; ComponentLink1Description: https://datasheet.ciiva.com/26920/getdatasheetpartid-359683-26920169.pdf?src-supplier=Verical; ComponentLink2URL: https://datasheet.ciiva.com/29198/458718-da-01-en-vs-kondensator-0402-29198423.pdf?src-supplier=Conrad; ComponentLink2Description: https://datasheet.ciiva.com/29198/458718-da-01-en-vs-kondensator-0402-29198423.pdf?src-supplier=Conrad; ComponentLink3URL: https://datasheet.ciiva.com/16208/cl05b104kq5nnnc-16208343.pdf?src-supplier=Future+Electronics; ComponentLink3Description: https://datasheet.ciiva.com/16208/cl05b104kq5nnnc-16208343.pdf?src-supplier=Future+Electronics; ComponentLink4URL: https://datasheet.ciiva.com/26309/mlcc-catalogdownload2013-eng-26309003.pdf?src-supplier=Distrelec; ComponentLink4Description: https://datasheet.ciiva.com/26309/mlcc-catalogdownload2013-eng-26309003.pdf?src-supplier=Distrelec; Supplier Part Number 1: 1276-1001-6-ND
D7-D13 = CMP-08607-000062-1: TVS DIODE 7V 10V 0402; Manufacturer: Littelfuse; Value: 0.1pF; Breakdown Voltage: 9.8V; Number Of Channels: 1; Peak Pulse Current: 2A; Direction: Bidirectional; Automotive Grade: Grade 1; Standoff Height: 0mm; Octopart: https://octopart.com/rf2945-000-littelfuse-56516902; Device Class L3: unset; ComponentLink2Description: Datasheet; Lead Free: Yes; Temperature Range Low: -55°C; Clamping Voltage: 10V; Digikey Description: TVS DIODE 7V 10V 0402; Category: Diode; Temperature: -55°C to +125°C; Device Class L1: Circuit Protection; Capacitance: 0.1pF; RoHS: TRUE; Device Class L2: TVS Diodes; Package: SESD0402; Reverse Standoff Voltage: 7V; Automotive: Yes; Height: 0.43mm; Manufacturer Part Number: RF2945-000; Temperature Range High: +125°C; ComponentLink2URL: https://www.littelfuse.com/~/media/electronics/datasheets/tvs_diode_arrays/littelfuse_tvs_diode_array_sesd_ultra_low_capacitance_discrete_tvs_datasheet.pdf.pdf
J4 = CONN_MICROSD_MEM2075-00-140-01-A: Memory Card Connectors Micro SD Push-Push, SMT, 1.40mm Profile, With Peg, Open Switch, T&R; Manufacturer: Global Connector Technology; Supplier 1: Verical; Manufacturer Part Number: MEM2075-00-140-01-A; RoHS: No; Category: Connectors; Stock 1: 1000; Pricing 1: 1000=1.6923 (USD); Mount: Surface Mount; Number of Pins: 8NUMBER; Contact Plating: Gold; Housing Material: 4896ConductorMaterial; Connector Type: Connector; Series: MEM2075; Packaging: Tape and Reel; ComponentLink1URL: https://gct.co/files/drawings/mem2075.pdf?src-supplier=Digikey; ComponentLink1Description: https://gct.co/files/drawings/mem2075.pdf?src-supplier=Digikey; ComponentLink2URL: https://datasheet.octopart.com/MEM2075-00-140-01-A-GCT-datasheet-166929309.pdf?src-supplier=TME; ComponentLink2Description: https://datasheet.octopart.com/MEM2075-00-140-01-A-GCT-datasheet-166929309.pdf?src-supplier=TME; Supplier Part Number 1: MEM2075-00-140-01-A
R107-R112 = RMCF0402FT47K0: RES 47K OHM 1% 1/16W 0402; Manufacturer: Stackpole Electronics Inc; Power (Watts): 0.063W, 1/16W; Temperature Coefficient: ±100ppm/°C; Part Number: RMCF0402FT47K0; Value: 47 kOhms; ComponentLink1Description: Datasheet; ComponentLink1URL: https://www.seielect.com/catalog/sei-rmcf_rmcp.pdf; ComponentLink2Description: DigiKey Link; ComponentLink2URL: https://www.digikey.com/en/products/detail/stackpole-electronics-inc/RMCF0402FT47K0/1714749; Composition: Thick Film; Device Package: 0402 (1005 Metric); Features: Automotive AEC-Q200; Height - Seated (Max): 0.016" (0.40mm); LastUpdated: 2/9/2024 8:30:13 PM; Lifecycle Status: Active; Minimum Order: 1; Number of Terminations: 2; Operating Temperature: -55°C ~ 155°C; Package / Case: 0402 (1005 Metric); Packaging: CutTape; PartId: 4957; Part Status: Active; Price: 0.01; Ratings: AEC-Q200; Resistance: 47 kOhms; Series: RMCF; Size / Dimension: 0.039" L x 0.020" W (1.00mm x 0.50mm); Supplier 1: DigiKey; Supplier Part Number 1: RMCF0402FT47K0CT-ND; Supplier Device Package: 0402; Tolerance: ±1%

## Sheet WIFI_BLE.SchDoc
size A2; DrawnBy: UKAYACIK; Engineer: UKAYACIK; DocumentNumber: 19; SheetNumber: 19; SheetTotal: 21
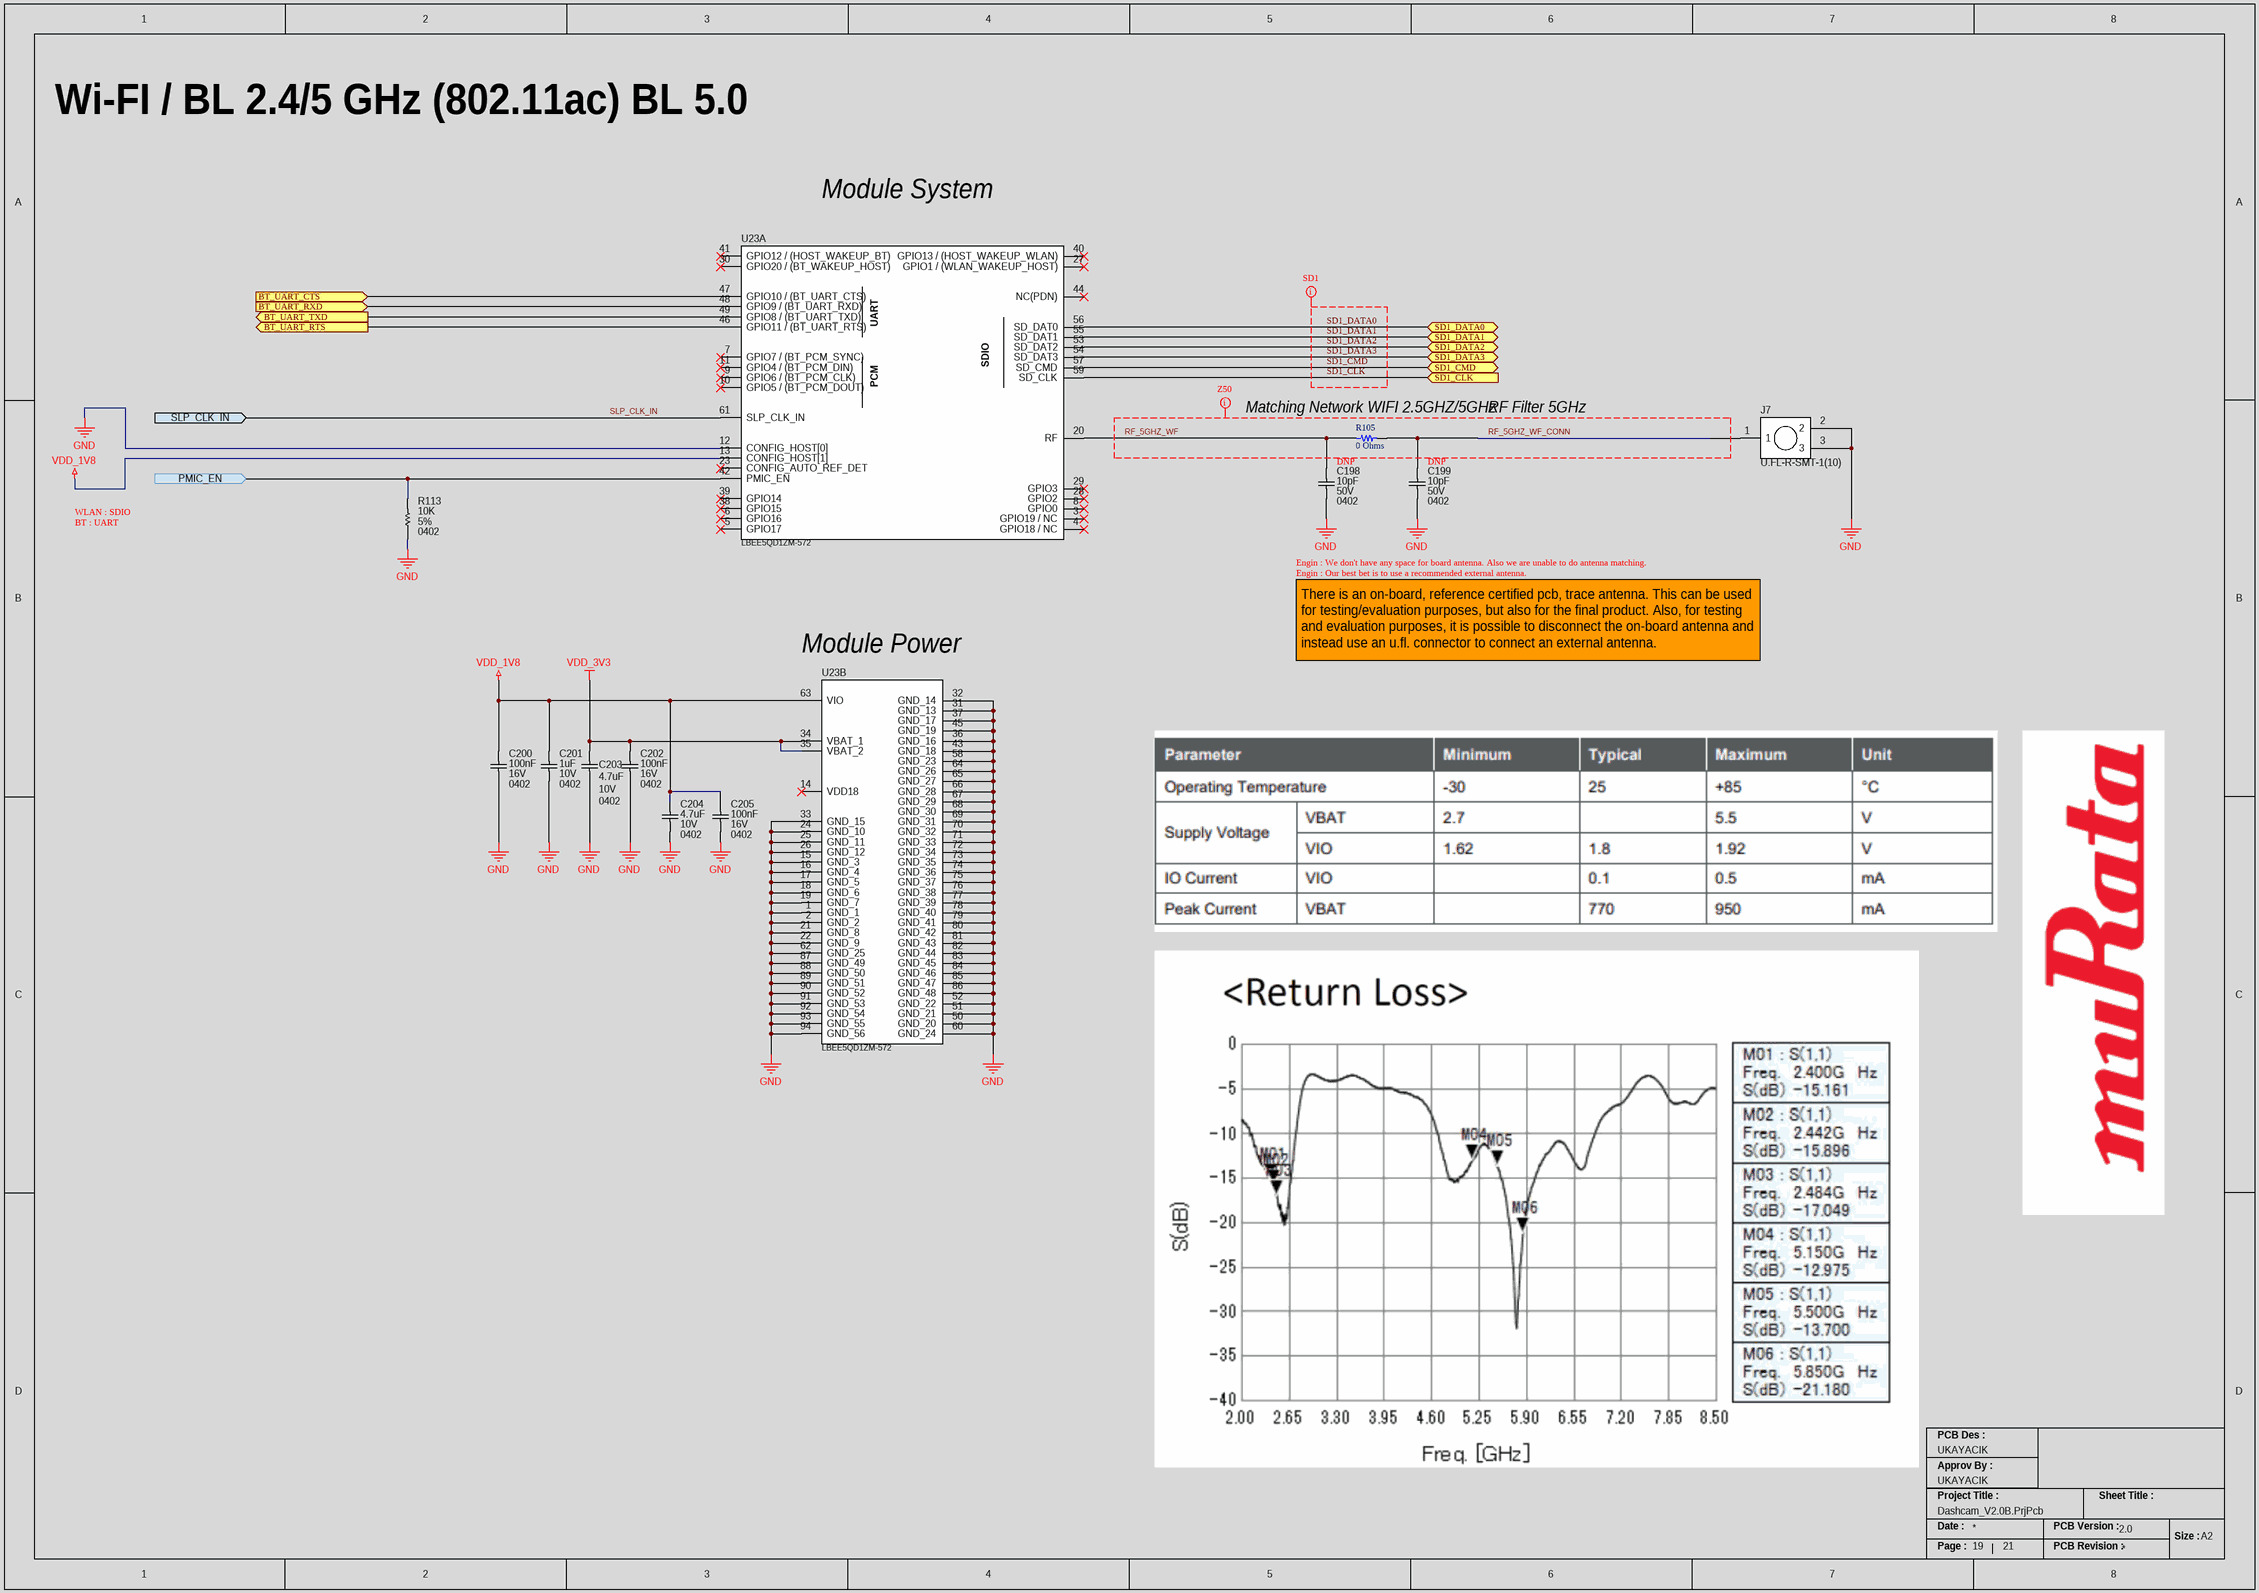
[diagram p21: WIFI_BLE.SchDoc]

### Parts
C198  Case/Package: 0402  Voltage Rating: 50V  Capacitance: 10pF  [CAP_0402_CAPC1005X05N]  (hidden comment: GJM1555C1H100FB01D)
C199  Case/Package: 0402  Voltage Rating: 50V  Capacitance: 10pF  [CAP_0402_CAPC1005X05N]  (hidden comment: GJM1555C1H100FB01D)
C200  Voltage Rating: 16V  Capacitance: 100nF  Case/Package: 0402  [CAP_0402_CAPC1005X05N]  (hidden comment: CL05B104KO5NNNC)
C201  Voltage Rating: 10V  Capacitance: 1uF  Case/Package: 0402  [CAP_0402_CAPC1005X05N]  (hidden comment: GRM155C81A105KA12D)
C202  Voltage Rating: 16V  Capacitance: 100nF  Case/Package: 0402  [CAP_0402_CAPC1005X05N]  (hidden comment: CL05B104KO5NNNC)
C203  Capacitance: 4.7uF  Voltage Rating: 10V  Case/Package: 0402  [CAP_0402_CAPC1005X05N]  (hidden comment: CL05A475KP5NRNC)
C204  Capacitance: 4.7uF  Voltage Rating: 10V  Case/Package: 0402  [CAP_0402_CAPC1005X05N]  (hidden comment: CL05A475KP5NRNC)
C205  Voltage Rating: 16V  Capacitance: 100nF  Case/Package: 0402  [CAP_0402_CAPC1005X05N]  (hidden comment: CL05B104KO5NNNC)
J7  U.FL-R-SMT-1(10)  [CONN_UFL_U.FL-R-SMT-1(10)]
R105  0 Ohms  [RES 0402_1005]
R113  Tolerance: 5%  Resistance: 10K  Case/Package: 0402  [RES_0402_RESC1005X04N]  (hidden comment: ERJ-2GEJ103X)
U23  LBEE5QD1ZM-572  [IC_WIFI_BLE_LBEE5QD1ZM572]  (parts A,B of 2)

### Ports
BT_UART_CTS (in), BT_UART_RTS (out), BT_UART_RXD (in), BT_UART_TXD (out), PMIC_EN (in), SD1_CLK (in), SD1_CMD (bidir), SD1_DATA0 (bidir), SD1_DATA1 (bidir), SD1_DATA2 (bidir), SD1_DATA3 (bidir), SLP_CLK_IN (in)

### Nets
GND: C198.1 C199.1 C200.1 C201.1 C202.1 C203.1 C204.1 C205.1 J7.2 J7.3 R113.1 U23.1(GND_1) U23.2(GND_2) U23.12(CONFIG_HOST[0]) U23.15(GND_3) U23.16(GND_4) U23.17(GND_5) U23.18(GND_6) U23.19(GND_7) U23.21(GND_8) U23.22(GND_9) U23.24(GND_10) U23.25(GND_11) U23.26(GND_12) U23.31(GND_13) U23.32(GND_14) U23.33(GND_15) U23.36(GND_16) U23.37(GND_17) U23.43(GND_18) U23.45(GND_19) U23.50(GND_20) U23.51(GND_21) U23.52(GND_22) U23.58(GND_23) U23.60(GND_24) U23.62(GND_25) U23.64(GND_26) U23.65(GND_27) U23.66(GND_28) U23.67(GND_29) U23.68(GND_30) U23.69(GND_31) U23.70(GND_32) U23.71(GND_33) U23.72(GND_34) U23.73(GND_35) U23.74(GND_36) U23.75(GND_37) U23.76(GND_38) U23.77(GND_39) U23.78(GND_40) U23.79(GND_41) U23.80(GND_42) U23.81(GND_43) U23.82(GND_44) U23.83(GND_45) U23.84(GND_46) U23.85(GND_47) U23.86(GND_48) U23.87(GND_49) U23.88(GND_50) U23.89(GND_51) U23.90(GND_52) U23.91(GND_53) U23.92(GND_54) U23.93(GND_55) U23.94(GND_56)
VDD_1V8: C200.2 C201.2 C204.2 C205.2 U23.13(CONFIG_HOST[1]) U23.63(VIO)
VDD_3V3: C202.2 C203.2 U23.34(VBAT_1) U23.35(VBAT_2)
BT_UART_CTS: U23.47(GPIO10_/_(BT_UART_CTS)) ; port BT_UART_CTS
BT_UART_RTS: U23.46(GPIO11_/_(BT_UART_RTS)) ; port BT_UART_RTS
BT_UART_RXD: U23.48(GPIO9_/_(BT_UART_RXD)) ; port BT_UART_RXD
BT_UART_TXD: U23.49(GPIO8_/_(BT_UART_TXD)) ; port BT_UART_TXD
GPIO1_IO00: R113.2 U23.42(PMIC_EN) ; port PMIC_EN
RF_5GHZ_WF: C198.2 R105.1 U23.20(RF)
RF_5GHZ_WF_CONN: C199.2 J7.1 R105.2
SD1_CLK: U23.59(SD_CLK) ; port SD1_CLK
SD1_CMD: U23.57(SD_CMD) ; port SD1_CMD
SD1_DATA0: U23.56(SD_DAT0) ; port SD1_DATA0
SD1_DATA1: U23.55(SD_DAT1) ; port SD1_DATA1
SD1_DATA2: U23.53(SD_DAT2) ; port SD1_DATA2
SD1_DATA3: U23.54(SD_DAT3) ; port SD1_DATA3
SLP_CLK_IN: U23.61(SLP_CLK_IN) ; port SLP_CLK_IN

Not connected (* = marked no-connect by the designer): U23 3(GPIO19_/_NC)* 4(GPIO18_/_NC)* 5(GPIO17)* 6(GPIO16)* 7(GPIO7_/_(BT_PCM_SYNC)_)* 8(GPIO0)* 9(GPIO6_/_(BT_PCM_CLK))* 10(GPIO5_/_(BT_PCM_DOUT))* 11(GPIO4_/_(BT_PCM_DIN))* 14(VDD18)* 23(CONFIG_AUTO_REF_DET)* 27(GPIO1_/_(WLAN_WAKEUP_HOST))* 28(GPIO2)* 29(GPIO3)* 30(GPIO20_/_(BT_WAKEUP_HOST))* 38(GPIO15)* 39(GPIO14)* 40(GPIO13_/_(HOST_WAKEUP_WLAN))* 41(GPIO12_/_(HOST_WAKEUP_BT))* 44(NC(PDN))*

### Layout directives
net class Z50: RF_5GHZ_WF, RF_5GHZ_WF_CONN
net class MICROSD1: SD1_CLK, SD1_CMD, SD1_DATA0, SD1_DATA1, SD1_DATA2, SD1_DATA3

### Notes on the sheet
- Wi-FI / BL 2.4/5 GHz (802.11ac) BL 5.0
- Module System
- (near R105) Matching Network WIFI 2.5GHZ/5GHz
- RF Filter 5GHz
- DNP
- (near C199) DNP
- WLAN : SDIO
- BT : UART
- Engin : We don't have any space for board antenna. Also we are unable to do antenna matching.
- Engin : Our best bet is to use a recommended external antenna.
- Module Power
- There is an on-board, reference certified pcb, trace antenna. This can be used for testing/evaluation purposes, but also for the final product. Also, for testing and evaluation purposes, it is possible to disconnect the on-board antenna and instead use an u.fl. connector to connect an external antenna.
- PCB Des :
- Approv By :
- Project Title :
- Sheet Title :
- Date :
- Page :
- PCB Version :
- PCB Revision :
- Size :
- A2
- (in symbol IC_WIFI_BLE_LBEE5QD1ZM-572, part A) UART; SDIO; PCM

### Library data of the parts
C198 C199 = CAP_10PF_50V_NP0_0402: Multilayer Ceramic Capacitor, 10 pF, 50 V, ± 1%, C0G (NP0), 0402 [1005 Metric]; Manufacturer: Murata; Material: 4241ConductorMaterial; Temperature Coefficient: 30ppm/°C; Supplier 1: Digikey; Manufacturer Part Number: GJM1555C1H100FB01D; RoHS: Yes; Category: Ceramic Capacitors; Stock 1: 104534; Pricing 1: 1=0.17, 10=0.113, 50=0.0676, 100=0.0532, 500=0.03926, 1000=0.03251, 2500=0.03026, 5000=0.02768 (USD); Mount: Surface Mount; Case Code (Imperial): 0402; Case Code (Metric): 1005; Weight: 2.3E-05oz; Min Operating Temperature: -55°C; Max Operating Temperature: 125°C; Packaging: Tape and Reel; Tolerance: 1%; Voltage Rating (DC): 50V; Dielectric: C0G; Termination: SMD/SMT; Voltage: 50V; Series: GJM; Construction: Flat; Length: 1mm; Width: 0.02inch; Height: 0.5mm; Thickness: 0.022inch; Depth: 0.5mm; Radiation Hardening: No; Reach SVHC Compliant: No; Lead Free: Lead Free; RoHS Compliant: Yes; ComponentLink1URL: https://datasheet.ciiva.com/11607/c02e-11607390.pdf?src-supplier=Avnet; ComponentLink1Description: https://datasheet.ciiva.com/11607/c02e-11607390.pdf?src-supplier=Avnet; Supplier Part Number 1: 490-11189-1-ND
C200 C202 C205 = CAP_100NF_16V_X7R_0402: as C185 on sheet uSD CARD; Supplier 1: Digi-Key; Manufacturer Part Number: CL05B104KO5NNNC; RoHS: Yes; Category: Ceramic Capacitors; Stock 1: 11081064; Pricing 1: 1=0.1, 10=0.024, 50=0.013, 100=0.0105, 500=0.00752, 1000=0.00592, 2500=0.00538, 5000=0.00495 (USD); Mount: Surface Mount; Case Code (Metric): 1005; Case Code (Imperial): 0402; Material: Ceramic; Min Operating Temperature: -55°C; Max Operating Temperature: 125°C; Tolerance: 10%; Package Quantity: 1; Packaging: Tape and Reel; Dielectric: X7R; Series: CL; Voltage: 16V; Voltage Rating (DC): 16V; Construction: Flat; Length: 1mm; Width: 0.02inch; Height: 0.5mm; Thickness: 0.022inch; Depth: 0.5mm; Radiation Hardening: No; RoHS Compliant: Yes; Lead Free: Lead Free; ComponentLink1URL: https://datasheet.ciiva.com/26920/getdatasheetpartid-359683-26920169.pdf?src-supplier=Verical; ComponentLink1Description: https://datasheet.ciiva.com/26920/getdatasheetpartid-359683-26920169.pdf?src-supplier=Verical; ComponentLink2URL: https://datasheet.ciiva.com/29198/458718-da-01-en-vs-kondensator-0402-29198423.pdf?src-supplier=Conrad; ComponentLink2Description: https://datasheet.ciiva.com/29198/458718-da-01-en-vs-kondensator-0402-29198423.pdf?src-supplier=Conrad; ComponentLink3URL: https://datasheet.ciiva.com/16208/cl05b104kq5nnnc-16208343.pdf?src-supplier=Future+Electronics; ComponentLink3Description: https://datasheet.ciiva.com/16208/cl05b104kq5nnnc-16208343.pdf?src-supplier=Future+Electronics; ComponentLink4URL: https://datasheet.ciiva.com/26309/mlcc-catalogdownload2013-eng-26309003.pdf?src-supplier=Distrelec; ComponentLink4Description: https://datasheet.ciiva.com/26309/mlcc-catalogdownload2013-eng-26309003.pdf?src-supplier=Distrelec; Supplier Part Number 1: 1276-1001-6-ND
C201 = CAP_1UF_10V_X6S_0402: 0402 10 V 1 uF ±10% Tolerance X6S Multilayer Ceramic Capacitor; Manufacturer: Murata; Supplier 1: Digikey; Manufacturer Part Number: GRM155C81A105KA12D; RoHS: Yes; Category: Ceramic Capacitors; Stock 1: 2486564; Pricing 1: 1=0.1, 10=0.045, 50=0.026, 100=0.0202, 500=0.01518, 1000=0.01192, 2500=0.01084, 5000=0.00997 (USD); Mount: Surface Mount; Case Code (Metric): 1005; Material: Ceramic; Case Code (Imperial): 0402; Weight: 0.000212oz; Min Operating Temperature: -55°C; Max Operating Temperature: 105°C; Dielectric: X6S; Packaging: Tape and Reel; Termination: SMD/SMT; Voltage Rating (DC): 10V; Package Quantity: 10000; Series: GRM; Length: 1mm; Width: 0.5mm; Height: 0.5mm; Thickness: 0.022inch; Lead Free: Lead Free; RoHS Compliant: Yes; ComponentLink1URL: http://www.mouser.com/ds/2/281/c02e-2905.pdf?src-supplier=Mouser; ComponentLink1Description: http://www.mouser.com/ds/2/281/c02e-2905.pdf?src-supplier=Mouser; ComponentLink2URL: https://datasheet.octopart.com/GRM155C81A105KA12D-Murata-datasheet-22122223.pdf?src-supplier=Future+Electronics; ComponentLink2Description: https://datasheet.octopart.com/GRM155C81A105KA12D-Murata-datasheet-22122223.pdf?src-supplier=Future+Electronics; ComponentLink3URL: https://datasheet.octopart.com/GRM155C81A105KA12D-Murata-datasheet-149522926.pdf?src-supplier=Newark; ComponentLink3Description: https://datasheet.octopart.com/GRM155C81A105KA12D-Murata-datasheet-149522926.pdf?src-supplier=Newark; ComponentLink4URL: http://search.murata.co.jp/Ceramy/image/img/A01X/G101/ENG/GRM155C81A105KA12-01.pdf?src-supplier=Digikey; ComponentLink4Description: http://search.murata.co.jp/Ceramy/image/img/A01X/G101/ENG/GRM155C81A105KA12-01.pdf?src-supplier=Digikey; ComponentLink5URL: http://search.murata.co.jp/Ceramy/image/img/A01X/partnumbering_e_01.pdf?src-supplier=Digikey; ComponentLink5Description: http://search.murata.co.jp/Ceramy/image/img/A01X/partnumbering_e_01.pdf?src-supplier=Digikey; ComponentLink6URL: https://datasheet.octopart.com/GRM155C81A105KA12D-Murata-datasheet-165579666.pdf?src-supplier=TME; ComponentLink6Description: https://datasheet.octopart.com/GRM155C81A105KA12D-Murata-datasheet-165579666.pdf?src-supplier=TME; Supplier Part Number 1: 490-12699-6-ND; Tolerance: 10%
C203 C204 = CAP_4.7UF_10V_X5R_0402: Multilayer Ceramic Capacitor, 4.7 uF, 10 V, ± 10%, X5R, 0402 [1005 Metric]; Manufacturer: Samsung; Supplier 1: Digikey; Manufacturer Part Number: CL05A475KP5NRNC; RoHS: Yes; Category: Ceramic Capacitors; Stock 1: 748042; Pricing 1: 1=0.28, 10=0.184, 50=0.129, 100=0.1042, 500=0.0774, 1000=0.06772, 2500=0.0645, 5000=0.05966 (USD); Mount: Surface Mount; Case Code (Metric): 1005; Case Code (Imperial): 0402; Material: Ceramic; Min Operating Temperature: -55°C; Max Operating Temperature: 85°C; Tolerance: 10%; Packaging: Tape and Reel; Package Quantity: 1; Dielectric: X5R; Series: CL; Construction: Flat; Length: 1mm; Width: 0.02inch; Height: 0.5mm; Thickness: 0.022inch; Depth: 0.5mm; Radiation Hardening: No; RoHS Compliant: Yes; Lead Free: Lead Free; ComponentLink1URL: https://datasheet.ciiva.com/25724/cl05a475kp5nrnc-25724404.pdf?src-supplier=Digikey; ComponentLink1Description: https://datasheet.ciiva.com/25724/cl05a475kp5nrnc-25724404.pdf?src-supplier=Digikey; ComponentLink2URL: https://datasheet.ciiva.com/29198/458873-da-01-en-vs-kondensator-0402-29198304.pdf?src-supplier=Conrad; ComponentLink2Description: https://datasheet.ciiva.com/29198/458873-da-01-en-vs-kondensator-0402-29198304.pdf?src-supplier=Conrad; Supplier Part Number 1: 1276-1480-1-ND
J7 = CONN_UFL_RF_5OR_U.FL-R-SMT-1(10): RF Connector, 1 Contact(s), Male, Board Mount, Surface Mount Terminal, Receptacle; Manufacturer: Hirose; Body Material: Bronze; Body Plating: Silver; Dielectric Material: Polymer; Center Contact Plating: Gold; Impedance: 50R; Connector Type: Receptacle,Male Pin; Max Frequency: 6GHz; Number of Ports: 1; Mating Cycles: 30; Insulation Resistance: 500MR; Supplier 1: Digikey; Manufacturer Part Number: U.FL-R-SMT-1(10); RoHS: Yes; Category: RF / Coaxial Connectors; Stock 1: 174716; Pricing 1: 1=1.26, 10=1.064, 25=1.0208, 50=0.9988, 100=0.9555, 250=0.8686, 500=0.78174, 1000=0.69488 (USD); Mount: Surface Mount; Contact Material: Brass; Housing Color: Beige; Weight: 0.001764oz; Min Operating Temperature: -40°C; Max Operating Temperature: 90°C; Packaging: Tape and Reel; Package Quantity: 2500; Fastening Type: SNAP-ON; Termination: Solder; Series: U.FL; Orientation: Straight; RoHS Compliant: Yes; Lead Free: 5697LeadFree; ComponentLink1URL: https://datasheet.ciiva.com/11762/0900766b8105243f-11762474.pdf?src-supplier=Rs; ComponentLink1Description: https://datasheet.ciiva.com/11762/0900766b8105243f-11762474.pdf?src-supplier=Rs; ComponentLink2URL: https://datasheet.ciiva.com/7651/91524-7651914.pdf?src-supplier=Element14; ComponentLink2Description: https://datasheet.ciiva.com/7651/91524-7651914.pdf?src-supplier=Element14; ComponentLink3URL: https://datasheet.ciiva.com/7651/91524-7651915.pdf?src-supplier=Element14; ComponentLink3Description: https://datasheet.ciiva.com/7651/91524-7651915.pdf?src-supplier=Element14; Supplier Part Number 1: H11891DKR-ND
R105 = RCG04020000Z0ED: RES 0 OHM JUMPER 1/16W 0402; Manufacturer: Vishay Dale; Power (Watts): 0.063W, 1/16W; Part Number: RCG04020000Z0ED; Value: 0 Ohms; ComponentLink1Description: Datasheet; ComponentLink1URL: http://www.vishay.com/docs/20047/rcge3.pdf; ComponentLink2Description: DigiKey Link; ComponentLink2URL: https://www.digikey.com/en/products/detail/vishay-dale/RCG04020000Z0ED/4172496; Composition: Thick Film; Device Package: 0402 (1005 Metric); Height - Seated (Max): 0.016" (0.40mm); LastUpdated: 2/9/2024 8:30:12 PM; Lifecycle Status: Active; Minimum Order: 1; Number of Terminations: 2; Operating Temperature: -55°C ~ 155°C; Package / Case: 0402 (1005 Metric); Packaging: TapeAndReel; PartId: 5041; Part Status: Active; Price: 0.01; Resistance: 0 Ohms; Series: RCG e3; Size / Dimension: 0.039" L x 0.020" W (1.00mm x 0.50mm); Supplier 1: DigiKey; Supplier Part Number 1: 541-1887-1-ND; Supplier Device Package: 402; Tolerance: Jumper
R113 = RES_10K_5%_100mW_0402: Res Thick Film 0402 10K Ohm 5% 1/10W ±200ppm/°C Molded SMD Punched Carrier T/R; Manufacturer: Panasonic; Power Rating: 100mW; Voltage Rating: 50V; Supplier 1: Digi-Key; Manufacturer Part Number: ERJ-2GEJ103X; RoHS: Yes; Category: Chip SMD Resistors; Stock 1: 4696986; Pricing 1: 1=0.1, 10=0.021, 50=0.0132, 100=0.011, 500=0.00744, 1000=0.00639, 5000=0.00464 (USD); Mount: Surface Mount; Contact Plating: Tin; Case Code (Metric): 1005; Case Code (Imperial): 0402; Size Code: 0402; Min Operating Temperature: -55°C; Max Operating Temperature: 155°C; Temperature Coefficient: 200ppm/°C; Packaging: Cut Tape; Resistor Type: Thick Film; Package Quantity: 10000; Number of Terminations: 2; Termination: SMD/SMT; Max Power Dissipation: 100mW; Features: Automotive AEC-Q200; Series: ERJ; Resistance Tolerance: 5%; Technology: THICK FILM; Voltage Rating (DC): 50V; Length: 1mm; Width: 0.5mm; Height: 0.35mm; Depth: 0.5mm; Ratings: AEC-Q200; Radiation Hardening: No; Reach SVHC Compliant: No; RoHS Compliant: Yes; Lead Free: 5697LeadFree; ComponentLink1URL: https://datasheet.ciiva.com/27055/1935721-27055112.pdf?src-supplier=Jameco; ComponentLink1Description: https://datasheet.ciiva.com/27055/1935721-27055112.pdf?src-supplier=Jameco; ComponentLink2URL: https://datasheet.ciiva.com/11821/0900766b80f806dd-11821170.pdf?src-supplier=Rs; ComponentLink2Description: https://datasheet.ciiva.com/11821/0900766b80f806dd-11821170.pdf?src-supplier=Rs; ComponentLink3URL: https://datasheet.ciiva.com/43460/1678796-43460391.pdf?src-supplier=Farnell; ComponentLink3Description: https://datasheet.ciiva.com/43460/1678796-43460391.pdf?src-supplier=Farnell; ComponentLink4URL: https://datasheet.ciiva.com/22785/1678796-22785949.pdf?src-supplier=Farnell; ComponentLink4Description: https://datasheet.ciiva.com/22785/1678796-22785949.pdf?src-supplier=Farnell; ComponentLink5URL: https://datasheet.ciiva.com/46371/1678796-46371910.pdf?src-supplier=Element14; ComponentLink5Description: https://datasheet.ciiva.com/46371/1678796-46371910.pdf?src-supplier=Element14; ComponentLink6URL: https://datasheet.ciiva.com/28514/1678796-28514154.pdf?src-supplier=Element14; ComponentLink6Description: https://datasheet.ciiva.com/28514/1678796-28514154.pdf?src-supplier=Element14; ComponentLink7URL: https://datasheet.ciiva.com/24070/aoa0000ce1-37422-24070679.pdf?src-supplier=Mouser; ComponentLink7Description: https://datasheet.ciiva.com/24070/aoa0000ce1-37422-24070679.pdf?src-supplier=Mouser; ComponentLink8URL: https://datasheet.ciiva.com/16767/70260739-16767130.pdf?src-supplier=Allied+Electronics; ComponentLink8Description: https://datasheet.ciiva.com/16767/70260739-16767130.pdf?src-supplier=Allied+Electronics; ComponentLink9URL: https://datasheet.ciiva.com/16774/70260739-16774504.pdf?src-supplier=Allied+Electronics; ComponentLink9Description: https://datasheet.ciiva.com/16774/70260739-16774504.pdf?src-supplier=Allied+Electronics; ComponentLink10URL: https://datasheet.ciiva.com/9194/aoa0000ce1-9194140.pdf?src-supplier=Avnet; ComponentLink10Description: https://datasheet.ciiva.com/9194/aoa0000ce1-9194140.pdf?src-supplier=Avnet; Supplier Part Number 1: P10KJCT-ND
U23 = IC_WIFI_BLE_LBEE5QD1ZM-572: 2.4 to 5.825GHz Bluetooth WiFi 802.11a/b/g/-c, Bluetooth v5.1 Transceiver Module; Manufacturer_Name: Murata Electronics; Manufacturer: Murata; Datasheet Link: https://pl.mouser.com/datasheet/2/281/1/murata_type1zm-2006876.pdf; Height: 1.345mm; Manufacturer_Part_Number: LBEE5QD1ZM-572; Mouser Part Number: 81-LBEE5QD1ZM-572; Mouser Price/Stock: https://www.mouser.co.uk/ProductDetail/Murata-Electronics/LBEE5QD1ZM-572?qs=stqOd1AaK79ZX7AUUzAj%2FQ%3D%3D; Arrow Part Number: LBEE5QD1ZM-572; Arrow Price/Stock: https://www.arrow.com/en/products/lbee5qd1zm-572/murata-manufacturing?region=nac; Supplier: Mouser; Supplier Part Number: 81-LBEE5QD1ZM-572; Manufacturer Part Number: LBEE5QD1ZM-572; RoHS: No; Stock: 926; Pricing: 1=17.82, 10=16.11, 25=14.82, 50=14.48, 100=13.43, 250=12.74, 500=11.95, 1000=11.35, 10000=11.35 (USD)